# EAGLE design usb_dongle (EAGLE 4.92)
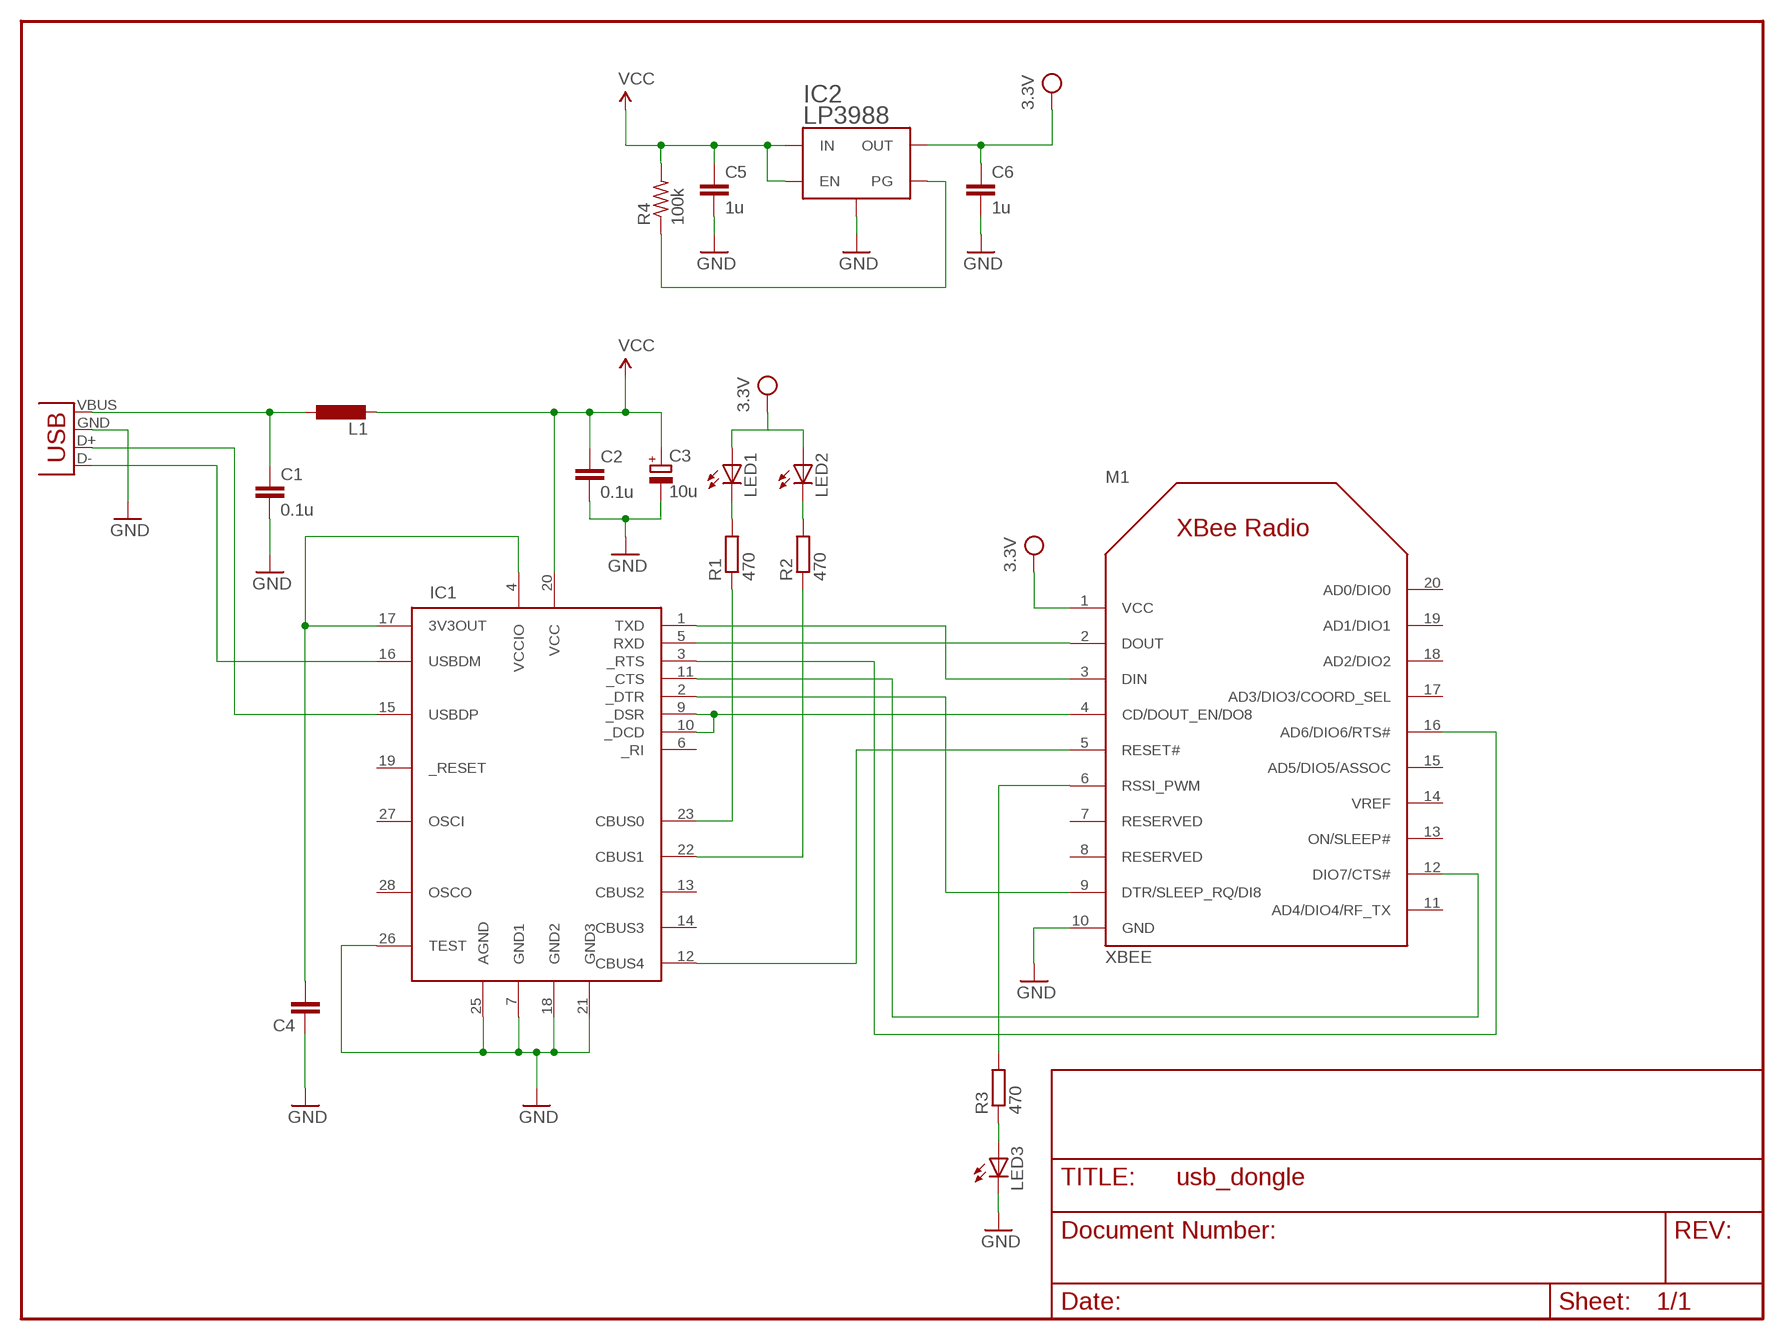
[diagram p0: schematic, sheet 1]

## Parts
C1  0.1u  C-EUC0603K  [C0603K]
C2  0.1u  C-EUC0603K  [C0603K]
C3  10u  CPOL-EUB  [PANASONIC_B]
C4  C-EUC0603K  [C0603K]
C5  1u  C-EUC1608  [C1608]
C6  1u  C-EUC1608  [C1608]
IC1  FT232RL  [SSOP28DB]
IC2  LP3988  [SOT-23-5]
L1  L-EUL2012C  [L2012C]
LED1  LEDCHIPLED_0603  [CHIPLED_0603]
LED2  LEDCHIPLED_0603  [CHIPLED_0603]
LED3  LEDCHIPLED_0603  [CHIPLED_0603]
M1  XBEE  [XBEE]
R1  470  R-EU_R0603  [R0603]
R2  470  R-EU_R0603  [R0603]
R3  470  R-EU_R0603  [R0603]
R4  100k  R-US_R0603  [R0603]
X1  USB-A-H  [USB-A-H]

## Nets
3V3: C6.1 IC2.P$5(OUT) LED1.A LED2.A M1.1(VCC) ; supply symbol labelled 3.3V
5V: C2.1 C3.+ C5.1 IC1.20(VCC) IC2.P$1(IN) IC2.P$3(EN) L1.2 R4.2 ; supply symbol labelled VCC
GND: C1.2 C2.2 C3.- C4.1 C5.2 C6.2 IC1.7(GND1) IC1.18(GND2) IC1.21(GND3) IC1.25(AGND) IC1.26(TEST) IC2.P$2(GND) LED3.C M1.10(GND) X1.GND(VBUS)
N$1: C4.2 IC1.4(VCCIO) IC1.17(3V3OUT)
N$2: IC1.5(RXD) M1.2(DOUT)
N$3: IC1.1(TXD) M1.3(DIN)
N$4: IC1.11(_CTS) M1.12(DIO7/CTS#)
N$5: IC1.15(USBDP) X1.D+(D-)
N$6: IC1.16(USBDM) X1.D-(D+)
N$7: C1.1 L1.1 X1.VBUS(GND)
N$8: IC1.3(_RTS) M1.16(AD6/DIO6/RTS#)
N$9: IC1.2(_DTR) M1.9(DTR/SLEEP_RQ/DI8)
N$10: IC1.12(CBUS4) M1.5(RESET#)
N$11: IC1.9(_DSR) IC1.10(_DCD) M1.4(CD/DOUT_EN/DO8)
N$12: M1.6(RSSI_PWM) R3.2
N$13: LED3.A R3.1
N$15: LED1.C R1.2
N$16: LED2.C R2.2
N$17: IC1.23(CBUS0) R1.1
N$18: IC1.22(CBUS1) R2.1
PG: IC2.P$4(PG) R4.1
Unconnected: IC1.6(_RI) IC1.13(CBUS2) IC1.14(CBUS3) IC1.19(_RESET) IC1.27(OSCI) IC1.28(OSCO) M1.7(RESERVED) M1.8(RESERVED) M1.11(AD4/DIO4/RF_TX) M1.13(ON/SLEEP#) M1.14(VREF) M1.15(AD5/DIO5/ASSOC) M1.17(AD3/DIO3/COORD_SEL) M1.18(AD2/DIO2) M1.19(AD1/DIO1) M1.20(AD0/DIO0)

## Library data of the parts
C1 C2 C4-C6 = rcl:C-EU: CAPACITOR, European symbol
C3 = rcl:CPOL-EU: POLARIZED CAPACITOR, European symbol
IC1 = SparkFun-3-2-07:FT232RL: USB UART FT232RL 4th Generation USB UART (USB <-> Serial) Controller. Spark Fun Electronics SKU : IC-FT232RL
IC2 = v-regulator_lp3988:LP3988
L1 = rcl:L-EU: INDUCTOR, European symbol
LED1-LED3 = led:LED: LED OSRAM: - CHIPLED LG R971, LG N971, LY N971, LG Q971, LY Q971, LO R971, LY R971 LH N974, LH R974 LS Q976, LO Q976, LY Q976 LO Q996 - Hyper CHIPLED LW Q18S LB Q993, LB Q99A, LB R99A - SideLED LS A670, LO A670, LY A670, LG A670, LP A670 LB A673, LV A673, LT A673, LW A673 LH A674 LY A675 LS A676, LA A676, LO A676, LY A676, LW A676 LS A679, LY A679, LG A679 - Hyper Micro SIDELED® LS Y876, LA Y876, LO Y876, LY Y876 LT Y87S - SmartLED LW L88C, LW L88S LB L89C, LB L89S, LG L890 LS L89K, LO L89K, LY L89K LS L896, LA L896, LO L896, LY L896 - TOPLED LS T670, LO T670, LY T670, LG T670, LP T670 LSG T670, LSP T670, LSY T670, LOP T670, LYG T670 LG T671, LOG T671, LSG T671 LB T673, LV T673, LT T673, LW T673 LH T674 LS T676, LA T676, LO T676, LY T676, LB T676, LH T676, LSB T676, LW T676 LB T67C, LV T67C, LT T67C, LS T67K, LO T67K, LY T67K, LW E67C LS E67B, LA E67B, LO E67B, LY E67B, LB E67C, LV E67C, LT E67C LW T67C LS T679, LY T679, LG T679 LS T770, LO T770, LY T770, LG T770, LP T770 LB T773, LV T773, LT T773, LW T773 LH T774 LS E675, LA E675, LY E675, LS T675 LS T776, LA T776, LO T776, LY T776, LB T776 LHGB T686 LT T68C, LB T68C - Hyper Mini TOPLED® LB M676 - Mini TOPLED Santana® LG M470 LS M47K, LO M47K, LY M47K Source: http://www.osram.convergy.de - LUMILED® LXK2-PW12-R00, LXK2-PW12-S00, LXK2-PW14-U00, LXK2-PW14-V00 LXK2-PM12-R00, LXK2-PM12-S00, LXK2-PM14-U00 LXK2-PE12-Q00, LXK2-PE12-R00, LXK2-PE12-S00, LXK2-PE14-T00, LXK2-PE14-U00 LXK2-PB12-K00, LXK2-PB12-L00, LXK2-PB12-M00, LXK2-PB14-N00, LXK2-PB14-P00, LXK2-PB14-Q00 LXK2-PR12-L00, LXK2-PR12-M00, LXK2-PR14-Q00, LXK2-PR14-R00 LXK2-PD12-Q00, LXK2-PD12-R00, LXK2-PD12-S00 LXK2-PH12-R00, LXK2-PH12-S00 LXK2-PL12-P00, LXK2-PL12-Q00, LXK2-PL12-R00 Source: www.luxeon.com
M1 = xbee_r1:XBEE
R1-R3 = rcl:R-EU_: RESISTOR, European symbol
R4 = rcl:R-US_: RESISTOR, American symbol
X1 = SparkFun-3-2-07:USB: USB Connectors USB-B-PTH is fully proven SKU : PType-USB-B USB-miniB is fully proven SKU : PType-USB-miniB USB-A-H is throughly reviewed, but untested. Spark Fun Electronics SKU : PType-USB-A USB-B-SMT is throughly reviewed, but untested. Needs silkscreen touching up. USB-A-S has not been used/tested USB-MB-H has not been used/tested

## Net classes
1 +5V: width 0.813 mm
2 +3V3: width 0.813 mm

## Board
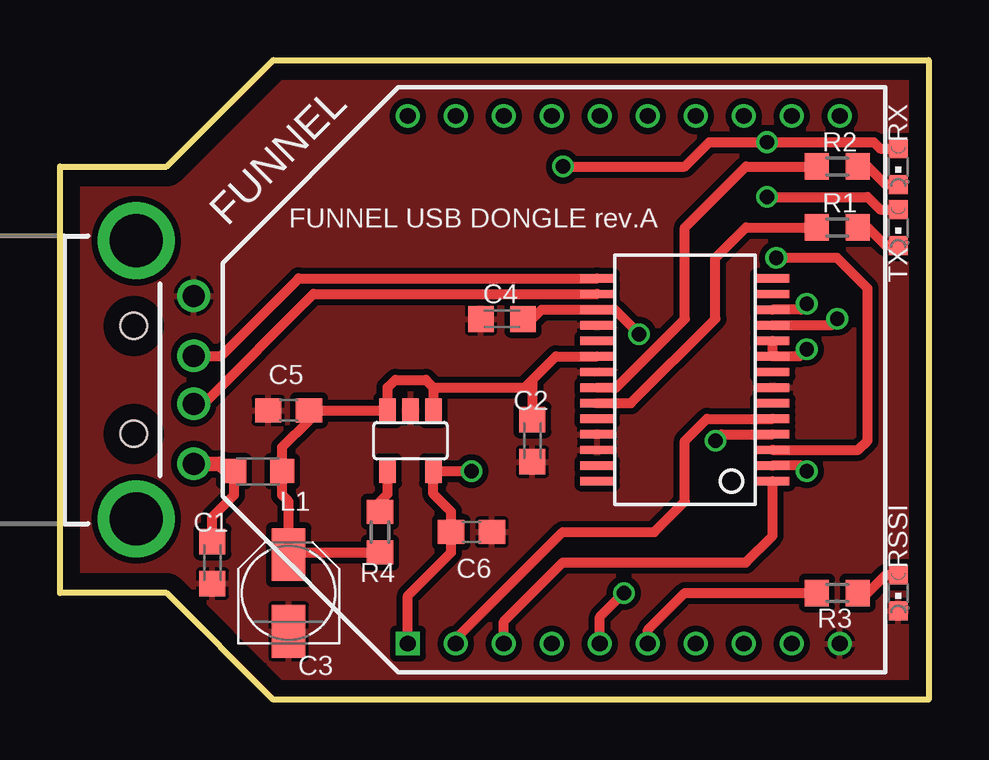
[diagram p1: board, top side]
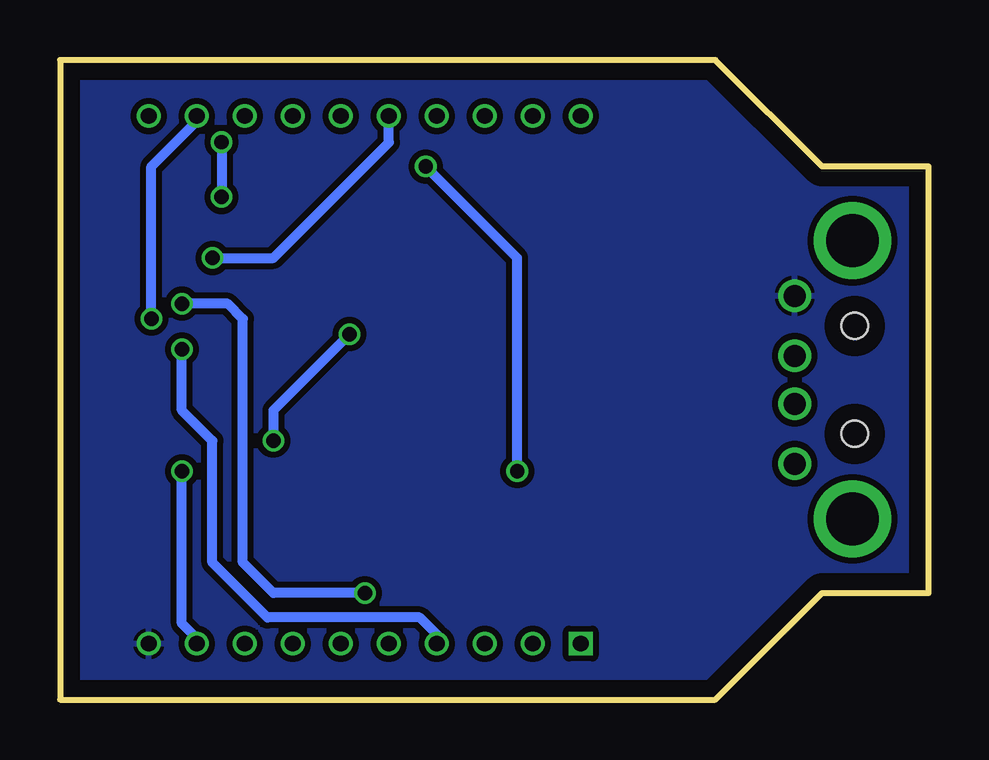
[diagram p2: board, bottom side, seen from below]

Size 36.2 x 26.67 mm. Coordinates in mm from the lower left corner, seen from the top.
Outline: 0,22.22 4.45,22.22 8.89,26.67 36.2,26.67 36.2,0 8.89,0 4.45,4.45 0,4.45 0,22.22
Copper layers (1*16): Top 0.035mm / dielectric 1.5mm / Bottom 0.035mm
Design rules "p-ban_min": minimum track width 0.15mm, minimum drill 0.3mm, track to track 0.15mm, track to pad 0.15mm, pad to pad 0.15mm, via to via 0.15mm, smd to smd 0.15mm, copper to edge 0.7mm, drill to drill 0.45mm, minimum pad ring 0.15mm, minimum via ring 0.15mm, stop-mask expansion 4mil, vias tented up to drill 0mil, thermal gap 0.15mm

### Footprints (pad centres in the part's own frame; a part is rotated, then mirrored left to right if it is on the bottom)
C0603K = smd 1.05 x 1.08: 1 -0.875,0; 2 0.875,0
PANASONIC_B = smd 2.2 x 1.4: + 1.6,0; - -1.6,0
C1608 = smd 1.1 x 1: 1 -0.85,0; 2 0.85,0
SSOP28DB = smd 0.348 x 1.397: 1 -4.225,-3.656; 2 -3.575,-3.656; 3 -2.925,-3.656; 4 -2.275,-3.656; 5 -1.625,-3.656; 6 -0.975,-3.656; 7 -0.325,-3.656; 8 0.325,-3.656; 9 0.975,-3.656; 10 1.625,-3.656; 11 2.275,-3.656; 12 2.925,-3.656; 13 3.575,-3.656; 14 4.225,-3.656; 15 4.225,3.656; 16 3.575,3.656; 17 2.925,3.656; 18 2.275,3.656; 19 1.625,3.656; 20 0.975,3.656; 21 0.325,3.656; 22 -0.325,3.656; 23 -0.975,3.656; 24 -1.625,3.656; 25 -2.275,3.656; 26 -2.925,3.656; 27 -3.575,3.656; 28 -4.225,3.656
SOT-23-5 = smd 0.686 x 0.991: P$1 -0.953,-1.27; P$2 0,-1.27; P$3 0.953,-1.27; P$4 0.953,1.27; P$5 -0.953,1.27
L2012C = smd 1 x 1: 1 -1,0; 2 1,0
CHIPLED_0603 = smd 0.8 x 0.8: A 0,-0.75; C 0,0.75
XBEE = drill 0.66 square: 1 -11,9 | drill 0.66 round: 2 -11,7; 3 -11,5; 4 -11,3; 5 -11,1; 6 -11,-1; 7 -11,-3; 8 -11,-5; 9 -11,-7; 10 -11,-9; 11 11,-9; 12 11,-7; 13 11,-5; 14 11,-3; 15 11,-1; 16 11,1; 17 11,3; 18 11,5; 19 11,7; 20 11,9
R0603 = smd 1 x 1.1: 1 -0.85,0; 2 0.85,0
USB-A-H = drill 0.914 round: D+ 2.4,1; D- 2.4,-1; GND 2.4,3.5; VBUS 2.4,-3.5 | drill 2.2 round: GND@1 0,5.8; GND@2 0,-5.8 | hole 1.1: -0.1,2.25; -0.1,-2.25

### Placement (x,y rotation side)
C1  6.35,5.71 270 top
C2  19.69,10.79 270 top
C3  9.53,4.45 90 top
C4  18.42,15.87 0 top
C5  9.53,12.07 180 top
C6  17.15,6.98 0 top
IC1  26.04,13.33 90 top
IC2  14.61,10.79 180 top
L1  8.26,9.53 0 top
LED1  34.92,19.68 180 top
LED2  34.92,22.22 180 top
LED3  34.92,4.45 180 top
M1  23.5,13.33 90 top
R1  32.38,19.68 0 top
R2  32.38,22.22 0 top
R3  32.38,4.45 180 top
R4  13.33,6.98 270 top
X1  3.17,13.33 0 top

### Tracks (layer width: path | path; a pad name or v marks a point on that pad's centre or on a via)
3V3  (via drill 0.6)
  Top 0.406: M1.1 14.49,4.33 16.3,6.13 C6.1 16.3,7.83 15.56,8.57 IC2.P$5 v17.15,9.53 | LED2.A 34.17,22.97 33.91,23.24 29.85,23.24 | LED1.A 34.17,20.43 33.66,20.96 v29.46,20.96 | v20.96,22.22 26.04,22.22 27.05,23.24 29.85,23.24 | 29.85,23.24 v29.46,23.24
  Bottom 0.406: v29.46,23.24 v29.46,20.96 | v17.15,9.53 17.15,18.41 v20.96,22.22
5V
  Top 0.406: 15.56,13.02 IC2.P$1 | 15.56,13.02 15.24,13.33 13.97,13.33 13.65,13.02 IC2.P$3 C5.1 10.38,11.64 9.25,10.53 L1.2 9.25,8.53 9.53,8.25 C3.+ 9.53,5.71 9.95,6.13 R4.2 | IC1.20 20.66,14.31 19.69,13.33 | 15.56,13.02 19.37,13.02 19.69,13.33 | 19.69,13.33 C2.1
GND
  pour Top (isolate 0.254): -1.91,28.57 38.73,28.57 38.73,-1.91 -1.91,-1.91
  pour Bottom (isolate 0.254): -0.64,27.3 37.46,27.3 37.46,-0.64 -0.64,-0.64
N$1  (via drill 0.6)
  Top 0.406: C4.2 19.69,15.87 20.07,16.26 IC1.17 23.11,16.26 v24.13,15.24 | IC1.4 27.57,11.06 v27.31,10.79
  Bottom 0.406: v27.31,10.79 27.31,12.07 v24.13,15.24
N$2
  Top 0.406: M1.2 16.5,2.52 20.96,6.98 24.77,6.98 26.04,8.25 26.04,10.79 26.95,11.71 IC1.5
N$3
  Top 0.406: IC1.1 29.69,6.83 28.58,5.71 20.96,5.71 18.5,3.25 M1.3
N$4  (via drill 0.6)
  Top 0.406: IC1.11 32.12,15.61 v32.38,15.87
  Bottom 0.406: v32.38,15.87 32.38,22.22 30.5,24.11 M1.12
N$5
  Top 0.406: IC1.15 9.94,17.56 6.71,14.33 X1.D+
N$6
  Top 0.406: X1.D- 5.98,12.33 10.56,16.91 IC1.16
N$7
  Top 0.406: C1.1 6.35,7.62 7.25,8.53 L1.1
  Top 0.61: L1.1 6.98,9.53 6.67,9.83 X1.VBUS
N$8  (via drill 0.6)
  Top 0.406: IC1.3 33.27,10.41 33.66,10.79 33.66,17.14 32.38,18.41 v29.85,18.41
  Bottom 0.406: v29.85,18.41 27.31,18.41 22.5,23.22 M1.16
N$9  (via drill 0.6)
  Top 0.406: IC1.2 30.88,9.76 v31.12,9.53
  Bottom 0.406: M1.9 30.5,2.55 31.12,3.18 v31.12,9.53
N$10  (via drill 0.6)
  Top 0.406: IC1.12 30.87,16.26 v31.12,16.51 | M1.5 22.5,3.45 v23.5,4.45
  Bottom 0.406: v31.12,16.51 29.21,16.51 28.58,15.87 28.58,5.71 27.31,4.45 v23.5,4.45
N$11  (via drill 0.6)
  Top 0.406: v31.12,14.61 30.82,14.31 IC1.9 29.69,14.83 29.72,14.86 29.69,14.89 IC1.10
  Bottom 0.406: v31.12,14.61 31.12,12.07 29.85,10.79 29.85,5.71 27.56,3.43 21.21,3.43 20.5,2.71 M1.4
N$12
  Top 0.406: M1.6 24.5,2.9 26.04,4.45 R3.2
N$13
  Top 0.406: R3.1 33.66,4.45 34.41,5.2 LED3.A
N$15
  Top 0.406: R1.2 33.66,19.68 34.41,18.93 LED1.C
N$16
  Top 0.406: R2.2 33.66,22.22 34.41,21.47 LED2.C
N$17
  Top 0.406: IC1.23 23.79,12.36 27.31,15.87 27.31,18.41 28.58,19.68 R1.1
N$18
  Top 0.406: IC1.22 23.17,13.01 26.04,15.87 26.04,19.68 28.58,22.22 R2.1
PG
  Top 0.406: R4.1 13.33,8.25 13.65,8.57 IC2.P$4

### Text on the board
tPlace: RX | FUNNEL | FUNNEL USB DONGLE rev.A | TX | RSSI